# Altium schematic sheet PWM.SchDoc: ZStation PWM
size A4; Engineer: Stephan Eersels; DocumentNumber: 12202925_ZS; Revision: 2.1; SheetNumber: 3; SheetTotal: 8
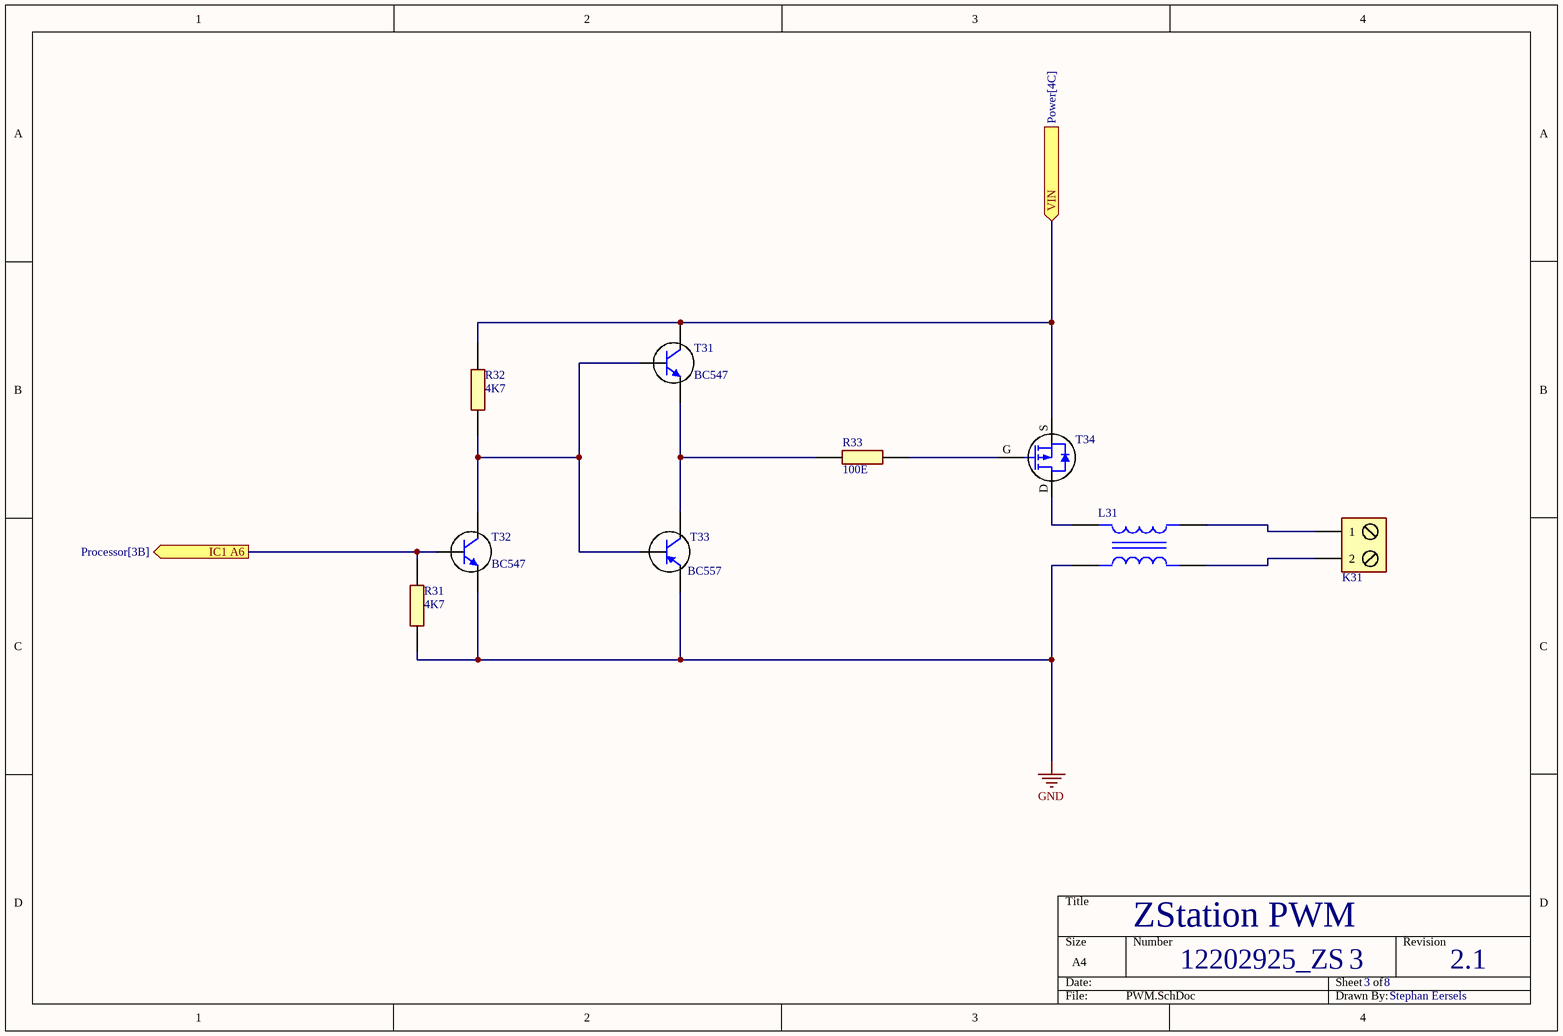
[diagram p0: PWM.SchDoc]

## Parts
K31  TBLOCK_2P  [TBLOCK_2P]  (value not drawn)
L31  Common_Mode_Choke  [2545]  (value not drawn)
R31  4K7  [VISHAY_CMF_60]
R32  4K7  [VISHAY_CMF_60]
R33  100E  [VISHAY_CMF_60]
T31  BC547  [ONSC-TO-92-3-29-11]
T32  BC547  [ONSC-TO-92-3-29-11]
T33  BC557  [ONSC-TO-92-3-29-11]
T34  IRF9Z34NPBF  [IRF9Z34NPBF]  (value not drawn)

## Ports
IC1 A6 (out, see Processor[3B]), VIN (in, see Power[4C])

## Nets
GND: L31.2 R31.1 T32.3(E) T33.3(E)
IC1 A6: R31.2 T32.2(B) ; port IC1 A6
VIN: R32.2 T31.1(C) T34.S(SOURCE) ; port VIN
NetK31_1: K31.1 L31.4
NetK31_2: K31.2 L31.3
NetL31_1: L31.1 T34.D(DRAIN)
NetR32_1: R32.1 T31.2(B) T32.1(C) T33.2(B)
NetR33_1: R33.1 T34.G(GATE)
NetR33_2: R33.2 T31.3(E) T33.1(C)

## Library data of the parts
K31 = TBLOCK_2P: Connector; Manufacturer_Name: Wurth Elektronik; Manufacturer_Part_Number: 691104700002; Height: 7.7mm; Mouser Part Number: 710-691104700002; Mouser Price/Stock: https://www.mouser.co.uk/ProductDetail/Wurth-Elektronik/691104700002?qs=sPbYRqrBIVlxnZf2zP2Y8g%3D%3D
L31 = Common_Mode_Choke: Max Current Rating: 2A; Number of Lines: 2; Impedance: 900R; Element Configuration: Dual; Insulation Resistance: 10MR; Test Frequency: 100MHz; DC Resistance (DCR): 60mR; Voltage Rating (DC): 50V; Current Rating: 2.3A; Number of Pins: 4; DC Current: 2A; Mount: Surface Mount; Current: 2A; REACH SVHC: No SVHC; Width: 4.5mm; Case/Package: 1808; Voltage Rating: 50V; Package Quantity: 1; Height: 2mm; Max DC Current: 2A; Packaging: Tape and Reel; Max Operating Temperature: 85°C; Lead Free: Lead Free; Length: 0.185inch; Series: ACM; Radiation Hardening: No; Max Voltage Rating (DC): 50V; Termination: Flat; Depth: 4.7mm; RoHS Compliant: Yes; DC Resistance-Max: 60mR; Min Operating Temperature: -40°C
R31-R33 = RES_68K_10K: Through Hole 1W 10/68 Kohms 1%; Manufacturer_Name: Vishay; Manufacturer_Part_Number: CMF6010K000FKEB; Datasheet Link: https://datasheet.datasheetarchive.com/originals/distributors/Datasheets-DGA8/3123891.pdf; Mouser Part Number: 71-CMF6010K000FKEB; Mouser Price/Stock: https://www.mouser.co.uk/ProductDetail/Vishay-Dale/CMF6010K000FKEB?qs=GEEnpASSx%2Fgpk8SPxIuFzw%3D%3D; Arrow Part Number: CMF6010K000FKEB; Arrow Price/Stock: https://www.arrow.com/en/products/cmf6010k000fkeb/vishay
T31 T32 = Transistor_NPN: Manufacturer: On Semiconductor; PartNumber: BC547C; IC Continuous (A): 0.1; fT Min (MHz): 150; Packing: Bulk Box; Polarity: NPN; Mounting Technology: Through Hole; ComponentLink1URL: http://www.onsemi.com/; ComponentLink1Description: Manufacturer URL; ComponentLink3URL: http://www.onsemi.cn/pub_link/Collateral/2N6426-D.PDF; DatasheetVersion: Rev. 7; PackageVersion: Rev. AM; RoHS: FALSE; ComponentLink2URL: http://www.onsemi.com/pub_link/Collateral/BC546-D.PDF; ComponentLink3Description: Package Specification; PackageDescription: 3-Pin Transistor Outline, Body 4.825 x 3.685 mm, Pitch 1.27 mm; PackageReference: TO-92-3-29-11_AM_SL; ComponentLink2Description: Datasheet
T33 = Transistor_PNP: Manufacturer: On Semiconductor; PartNumber: BC557C; Polarity: PNP; IC Continuous (A): -0.1; Packing: Bulk Box; PackageVersion: Rev. AM; RoHS: FALSE; PackageDescription: 3-Pin Transistor Outline, Body 4.825 x 3.685 mm, Pitch 1.27 mm; ComponentLink2Description: Datasheet; DatasheetVersion: Rev. 3; ComponentLink3Description: Package Specification; Mounting Technology: Through Hole; ComponentLink2URL: http://www.onsemi.com/pub_link/Collateral/BC556B-D.PDF; ComponentLink1URL: http://www.onsemi.com/; ComponentLink1Description: Manufacturer URL; ComponentLink3URL: http://www.onsemi.cn/pub_link/Collateral/2N6426-D.PDF; PackageReference: TO-92-3-29-11_AM_SL
T34 = MOSFET_P: Manufacturer: Fairchild Semiconductor; Reel Quantity: 3000; Drain Source Voltage Vds: 20V; Power Dissipation Pd: 500mW; On Resistance Rds(on): 52mohm; Full Power Rating Temperature: 25°C; Voltage Vgs Max: -800mV; Pulse Current Idm: 10A; Rds(on) Test Voltage Vgs: -4.5V; External Depth: 2.5mm; Transistor Case Style: SOT-23; No. of Pins: 3; Continuous Drain Current Id: 2.4A; Voltage Vds Typ: -20V; Voltage Vgs th Max: -1.5V; Transistor Polarity: PChannel; Package Version: Rev. 3, 05/2015; External Width: 3.05mm; External Length / Height: 1.12mm; SMD Marking: 304P; SVHC: NoSVHC(19-Dec-2012); Termination Type: SMD; Datasheet URL: https://www.fairchildsemi.com/datasheets/FD/FDN304P.pdf; Tape Width: 8mm; Mounting Technology: SurfaceMount; Voltage Vgs Rds on Measurement: -4.5V; Operating Temperature Range: -55°Cto+150°C; Current Temperature: 25°C; Operating Temperature Min: -55°C; Threshold Voltage Vgs Typ: -800mV; Package / Case: SOT-23; Manufacturer URL: https://www.fairchildsemi.com/; Voltage Vds: 20V; Datasheet Version: Rev. C, 01/2001; Operating Temperature Max: 150°C; Package Description: 3-Pin Small Outline Transistor, Body 2.92 x 1.4 mm, Pitch 0.95 mm; Current Id Max: 2.4A; Package URL: https://www.fairchildsemi.com/package-drawings/MA/MA03B.pdf; Package Reference: SSOT3L